# EAGLE design Driver (EAGLE 4.14)
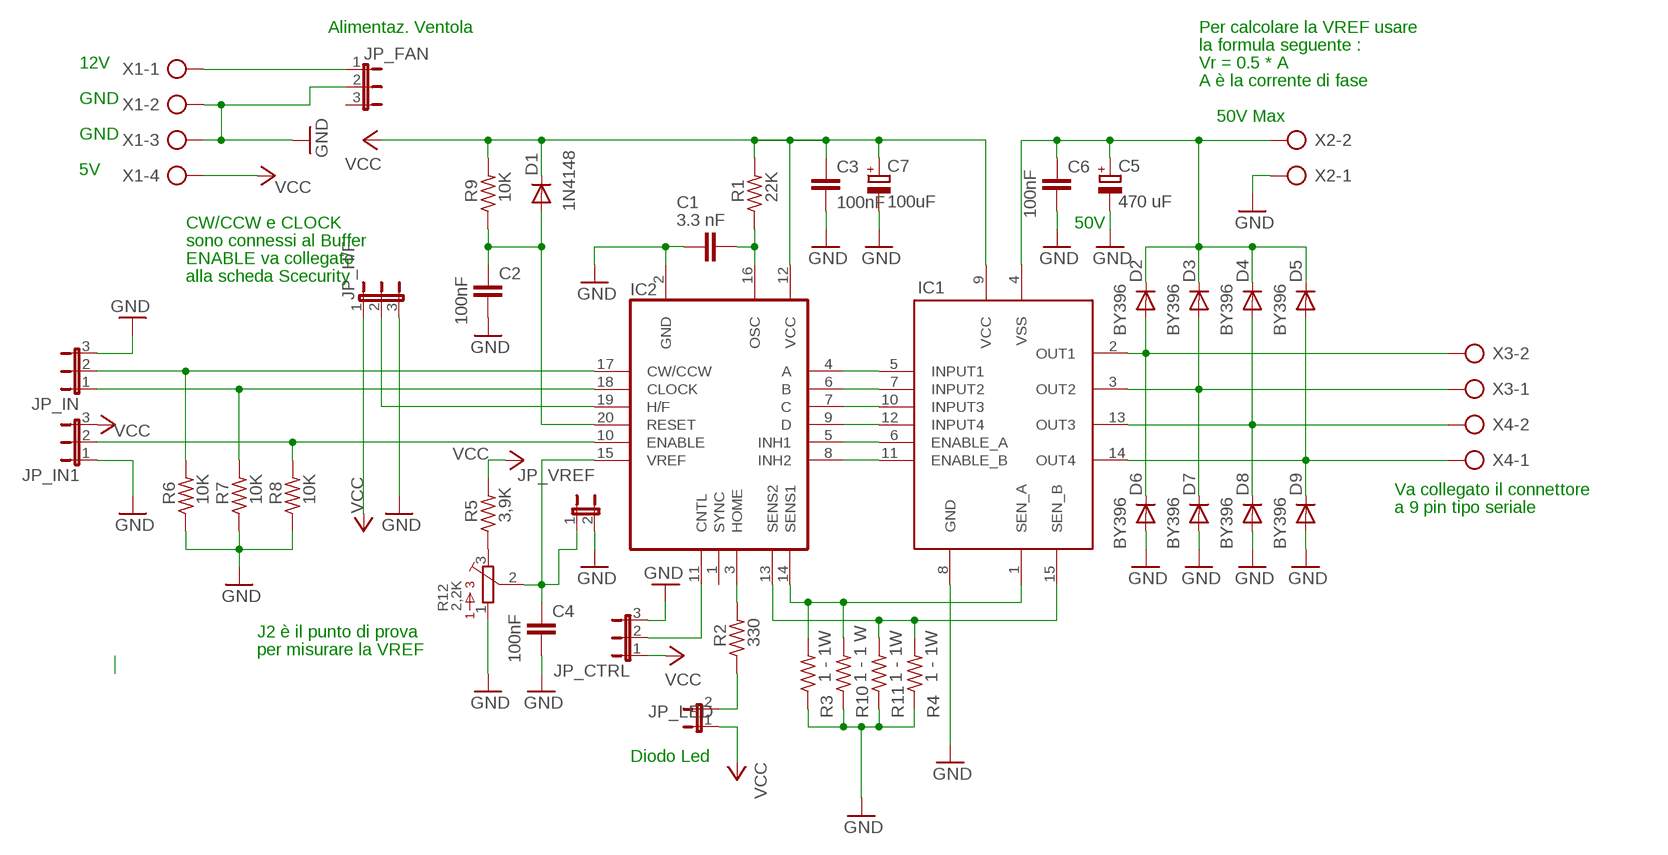
[diagram p0: schematic, sheet 1]

## Parts
C1  3.3 nF  C-EU050-024X044  [C050-024X044]
C2  100nF  C5/2.5  [C5B2.5]
C3  100nF  C5/2.5  [C5B2.5]
C4  100nF  C5/2.5  [C5B2.5]
C5  470 uF  CPOL-EUE5-10.5  [E5-10,5]
C6  100nF  C5/3.5  [C5B3.5]
C7  100uF  CPOL-EUE2.5-5  [E2,5-5]
D1  1N4148  [DO35-10]
D2  BY396  [DO201-15]
D3  BY396  [DO201-15]
D4  BY396  [DO201-15]
D5  BY396  [DO201-15]
D6  BY396  [DO201-15]
D7  BY396  [DO201-15]
D8  BY396  [DO201-15]
D9  BY396  [DO201-15]
IC1  L298  [MW-15]
IC2  L297  [DIL20]
JP_CTRL  JP2E  [JP2]
JP_FAN  JP2E  [JP2]
JP_H/F  JP2E  [JP2]
JP_IN  JP2E  [JP2]
JP_IN1  JP2E  [JP2]
JP_LED  JP1E  [JP1]
JP_VREF  JP1E  [JP1]
R1  22K  R-US_0207/12  [0207/12]
R2  330  R-US_0207/12  [0207/12]
R3  1 - 1W  R-US_0617/22  [0617/22]
R4  1 - 1W  R-US_0617/22  [0617/22]
R5  3,9K  R-US_0207/12  [0207/12]
R6  10K  R-US_0207/12  [0207/12]
R7  10K  R-US_0207/12  [0207/12]
R8  10K  R-US_0207/12  [0207/12]
R9  10K  R-US_0207/12  [0207/12]
R10  1 - 1 W  R-US_0617/22  [0617/22]
R11  1 - 1W  R-US_0617/22  [0617/22]
R12  2,2K  3386-X  [3386X]
X1  AK500/4  [AK500/4]
X2  AK300/2  [AK300/2]
X3  AK300/2  [AK300/2]
X4  AK300/2  [AK300/2]

## Nets
GND: C1.2 C2.2 C3.2 C4.2 C5.- C6.2 C7.- D6.A D7.A D8.A D9.A IC1.8(GND) IC2.2(GND) JP_CTRL.3 JP_FAN.2 JP_H/F.3 JP_IN1.1 JP_IN.3 JP_VREF.2 R3.1 R4.1 R6.1 R7.1 R8.1 R10.1 R11.1 R12.1 X1.2 X1.3 X2.1
N$1: IC2.17(CW/CCW) JP_IN.2 R6.2
N$2: IC2.18(CLOCK) JP_IN.1 R7.2
N$3: IC2.10(ENABLE) JP_IN1.2 R8.2
N$4: IC2.3(HOME) R2.2
N$5: JP_LED.2 R2.1
N$6: IC2.19(H/F) JP_H/F.2
N$7: C1.1 IC2.16(OSC) R1.1
N$8: IC1.12(INPUT4) IC2.9(D)
N$9: IC1.11(ENABLE_B) IC2.8(INH2)
N$10: IC1.10(INPUT3) IC2.7(C)
N$11: IC1.7(INPUT2) IC2.6(B)
N$12: IC1.6(ENABLE_A) IC2.5(INH1)
N$13: IC1.5(INPUT1) IC2.4(A)
N$15: IC1.1(SEN_A) IC2.14(SENS1) R3.2 R10.2
N$16: IC1.15(SEN_B) IC2.13(SENS2) R4.2 R11.2
N$17: JP_FAN.1 X1.1
N$22: C4.1 IC2.15(VREF) JP_VREF.1 R12.2
N$23: C2.1 D1.A IC2.20(RESET) R9.1
N$24: R5.1 R12.3
N$25: IC2.11(CNTL) JP_CTRL.2
N$26: D2.A D6.C IC1.2(OUT1) X3.2
N$27: D3.A D7.C IC1.3(OUT2) X3.1
N$28: D4.A D8.C IC1.13(OUT3) X4.2
N$29: D5.A D9.C IC1.14(OUT4) X4.1
N$30: C5.+ C6.1 D2.C D3.C D4.C D5.C IC1.4(VSS) X2.2
VCC: C3.1 C7.+ D1.C IC1.9(VCC) IC2.12(VCC) JP_CTRL.1 JP_H/F.1 JP_IN1.3 JP_LED.1 R1.2 R5.2 R9.2 X1.4
Unconnected: IC2.1(SYNC) JP_FAN.3

## Notes on the sheet
- Alimentaz. Ventola | Per calcolare la VREF usare
- la formula seguente :
- 12V | Vr = 0.5 * A
- A è la corrente di fase
- GND
- 50V Max
- GND
- 5V
- CW/CCW e CLOCK | 50V
- sono connessi al Buffer
- ENABLE va collegato
- alla scheda Scecurity
- Va collegato il connettore
- a 9 pin tipo seriale
- J2 è il punto di prova
- per misurare la VREF
- Diodo Led

## Library data of the parts
C1 = rcl:C-EU: CAPACITOR, European symbol
C2-C4 C6 = capacitor-wima:C: CAPACITOR naming: grid - package width
C5 C7 = rcl:CPOL-EU: POLARIZED CAPACITOR, European symbol
D1 = diode:1N4148: DIODE high speed (Philips)
D2-D9 = diode:BY396: DIODE Si,100 V, 3 A
IC1 = sgs-thom:L298
IC2 = sgs-thom:L297
JP_CTRL JP_FAN JP_H/F JP_IN JP_IN1 = jumper:JP2E: JUMPER
JP_LED JP_VREF = jumper:JP1E: JUMPER
R1-R11 = rcl:R-US_: RESISTOR, American symbol
R12 = BOURNS:3386-: 3386 Series 3/8" Square Trimmer
X1 = con-ptr500:AK500/4: CONNECTOR
X2-X4 = con-ptr500:AK300/2: CONNECTOR

## Board
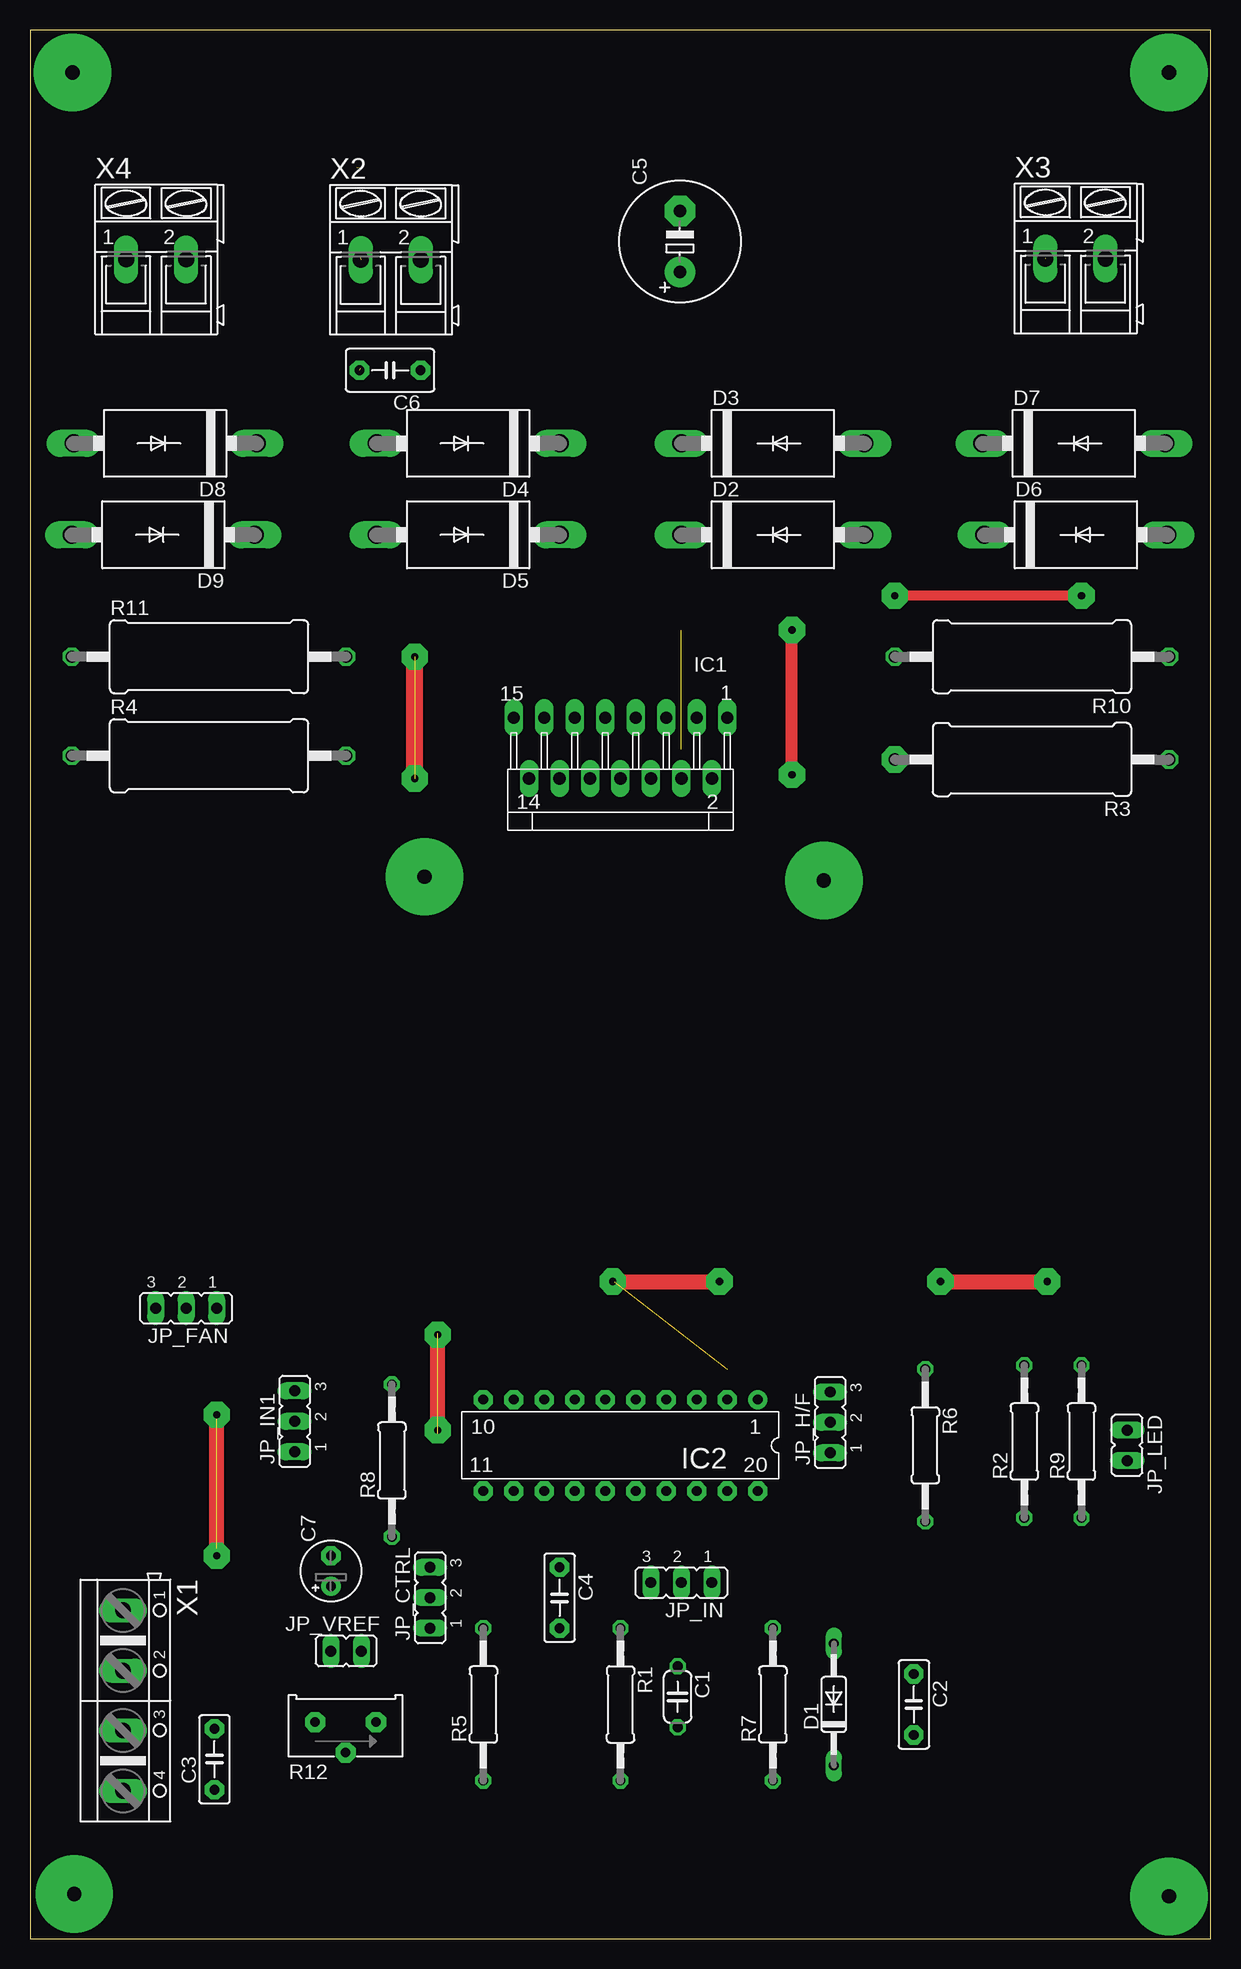
[diagram p1: board, top side]
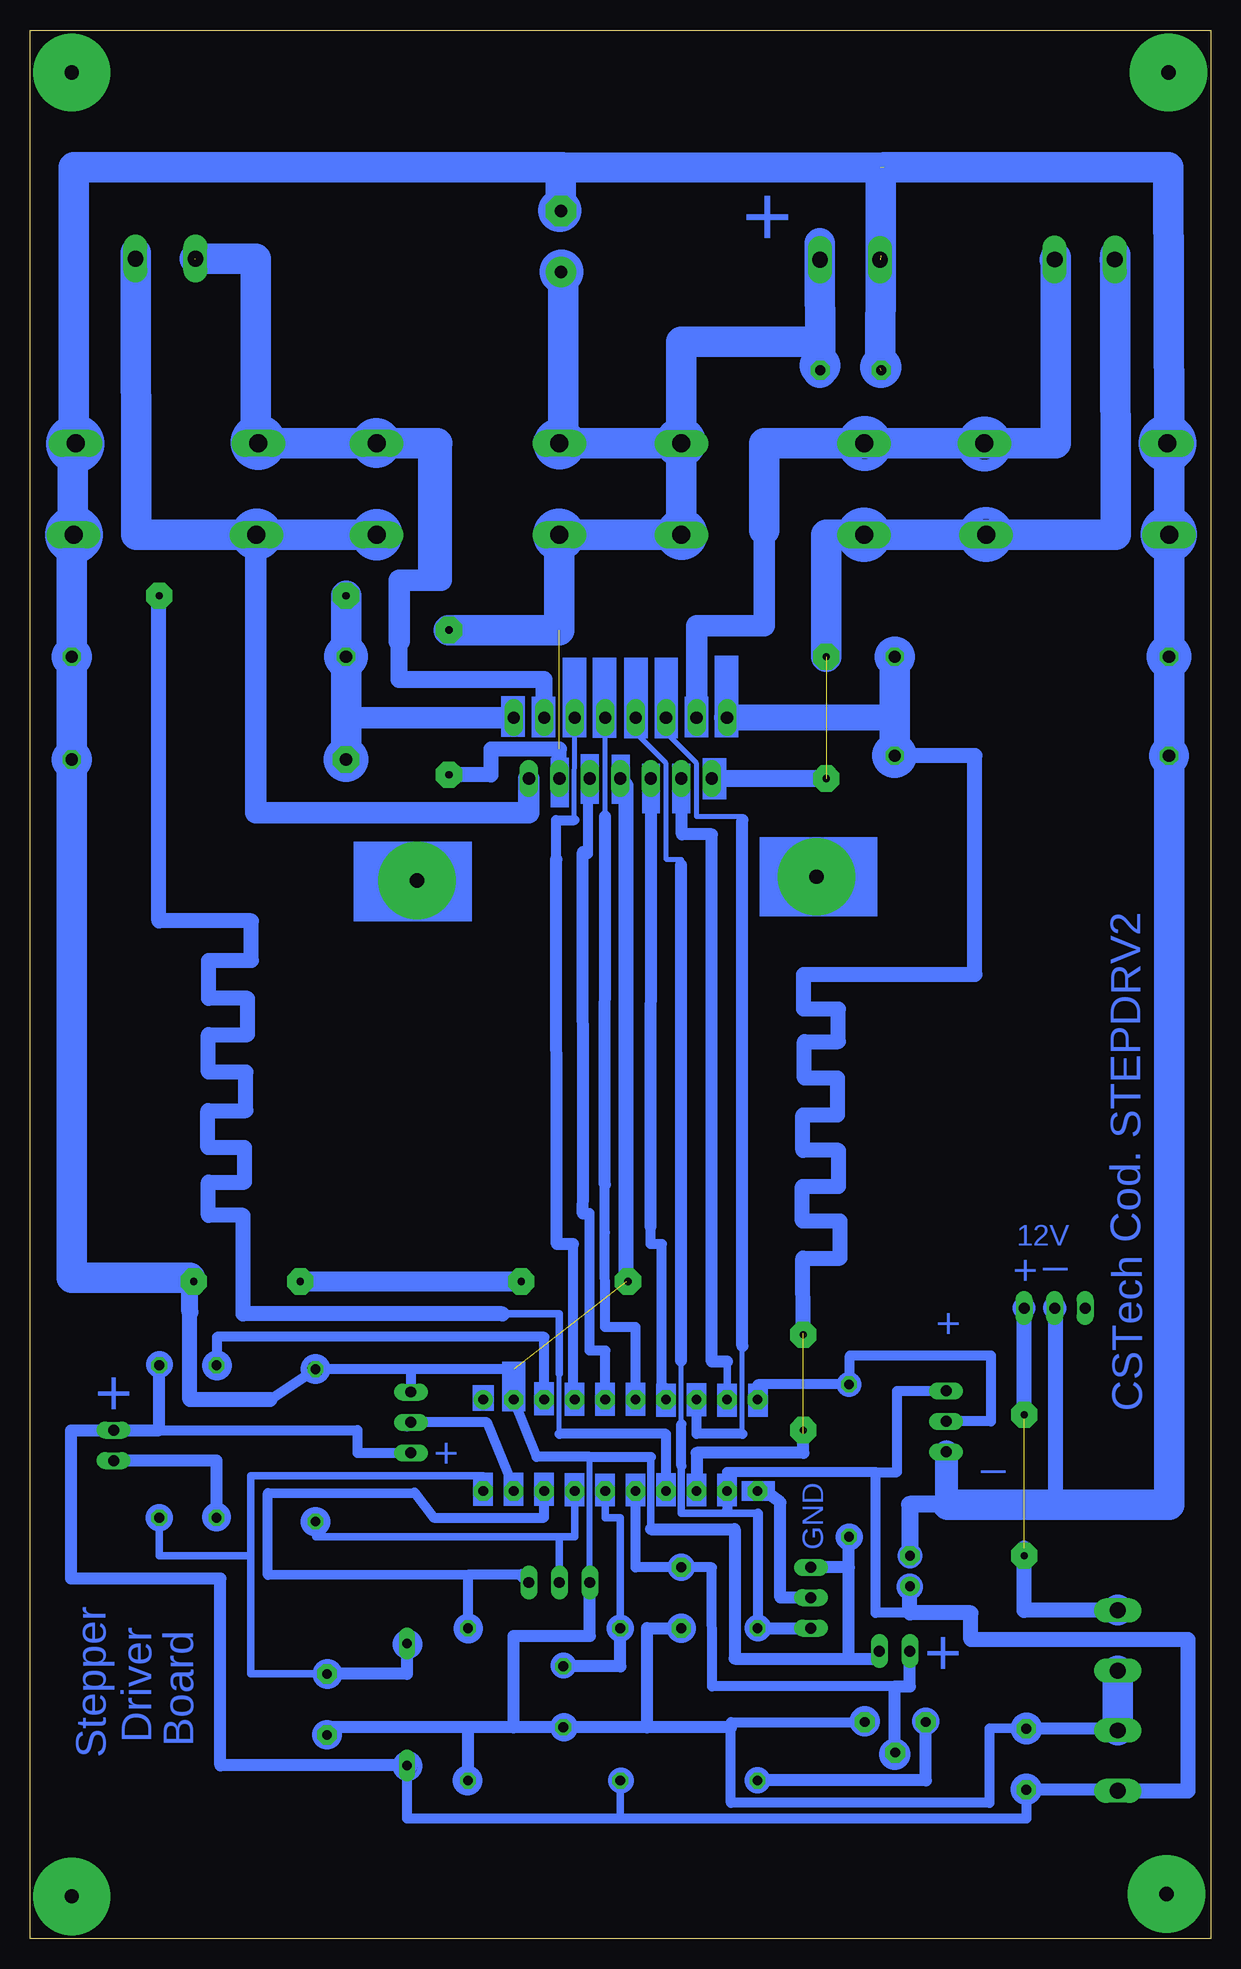
[diagram p2: board, bottom side, seen from below]

Size 98.41 x 159.06 mm. Coordinates in mm from the lower left corner, seen from the top.
Outline: 0,0 98.4,0 98.4,159.05 0,159.05 0,0
Copper layers (1*16): Top 0.035mm / dielectric 1.5mm / Bottom 0.035mm
Design rules "default": minimum track width 20mil, minimum drill 24mil, track to track 8mil, track to pad 8mil, pad to pad 8mil, via to via 8mil, smd to smd 8mil, copper to edge 40mil, drill to drill 8mil, minimum pad ring 10mil, minimum via ring 8mil, stop-mask expansion 4mil, vias tented up to drill 0mil, thermal gap 10mil

### Footprints (pad centres in the part's own frame; a part is rotated, then mirrored left to right if it is on the bottom)
C050-024X044 = drill 0.813 octagon: 1 -2.54,0; 2 2.54,0
C5B2.5 = drill 0.813 pad 1.6 octagon: 1 -2.54,0; 2 2.54,0
E5-10,5 = drill 1.016 pad 2.54 round: + -2.54,0 | drill 1.016 pad 2.54 octagon: - 2.54,0
C5B3.5 = drill 0.813 pad 1.6 octagon: 1 -2.54,0; 2 2.54,0
E2,5-5 = drill 0.813 pad 1.6 round: + -1.27,0 | drill 0.813 pad 1.6 octagon: - 1.27,0
DO35-10 = drill 0.813 long: A 5.08,0; C -5.08,0
DO201-15 = drill 1.499 long: A 7.62,0; C -7.62,0
MW-15 = drill 1.016 pad 1.27 long: 1 -8.89,-5.08; 2 -7.62,0; 3 -6.35,-5.08; 4 -5.08,0; 5 -3.81,-5.08; 6 -2.54,0; 7 -1.27,-5.08; 8 0,0; 9 1.27,-5.08; 10 2.54,0; 11 3.81,-5.08; 12 5.08,0; 13 6.35,-5.08; 14 7.62,0; 15 8.89,-5.08
DIL20 = drill 0.813 pad 1.6 round: 1 -11.43,-3.81 | drill 0.813 pad 1.6 octagon: 2 -8.89,-3.81; 3 -6.35,-3.81; 4 -3.81,-3.81; 5 -1.27,-3.81; 6 1.27,-3.81; 7 3.81,-3.81; 8 6.35,-3.81; 9 8.89,-3.81; 10 11.43,-3.81; 11 11.43,3.81; 12 8.89,3.81; 13 6.35,3.81; 14 3.81,3.81; 15 1.27,3.81; 16 -1.27,3.81; 17 -3.81,3.81; 18 -6.35,3.81; 19 -8.89,3.81; 20 -11.43,3.81
JP2 = drill 0.914 long: 1 -2.54,0; 2 0,0; 3 2.54,0
JP1 = drill 0.914 long: 1 0,-1.27; 2 0,1.27
0207/12 = drill 0.813 octagon: 1 -6.35,0; 2 6.35,0
0617/22 = drill 1.016 octagon: 1 -11.43,0; 2 11.43,0
3386X = drill 0.813 pad 1.676 octagon: 1 2.54,0.635; 2 0,-1.905; 3 -2.54,0.635
AK500/4 = drill 1.321 long: 1 -7.518,0; 2 -2.489,0; 3 2.489,0; 4 7.518,0
AK300/2 = drill 1.321 long: 1 -2.515,0; 2 2.489,0

### Placement (x,y rotation side)
C1  53.97,20.16 270 top
C2  73.66,19.52 270 top
C3  15.37,14.95 90 top
C4  44.13,28.41 270 top
C5  54.16,141.43 90 top
C6  30.01,130.7 180 top
C7  25.08,30.63 90 top
D1  66.99,19.52 90 top
D2  61.91,116.99 0 top
D3  61.91,124.61 0 top
D4  36.51,124.6 180 top
D5  36.51,116.99 180 top
D6  87.16,116.99 0 top
D7  86.99,124.61 0 top
D8  11.26,124.61 180 top
D9  11.11,116.99 180 top
IC1  49.21,96.67 180 top
IC2  49.21,41.11 180 top
JP_CTRL  33.33,28.41 90 top
JP_FAN  13.01,52.54 180 top
JP_H/F  66.67,43.02 90 top
JP_IN  54.29,29.68 180 top
JP_IN1  22.05,43.1 90 top
JP_LED  91.44,41.11 180 top
JP_VREF  26.35,23.96 270 top
R1  49.21,19.52 270 top
R2  82.86,41.43 90 top
R3  83.5,98.26 180 top
R4  14.92,98.58 0 top
R5  37.78,19.52 90 top
R6  74.61,41.11 270 top
R7  61.91,19.52 90 top
R8  30.16,39.84 90 top
R9  87.62,41.43 90 top
R10  83.5,106.83 180 top
R11  14.92,106.83 0 top
R12  26.3,17.41 0 top
X1  7.75,19.84 270 top
X2  30.08,139.9 0 top
X3  87.13,140 0 top
X4  10.52,139.93 0 top

### Tracks (layer width: path | path; a pad name or v marks a point on that pad's centre or on a via)
GND  (4 unrouted)
  Bottom 0.254: 3.49,123.98 D8.A | D9.A 3.49,117.63 | D7.A 94.75,125.88
  Bottom 0.508: C1.2 54.92,17.62 | R6.1 74.4,47.54 | JP_IN.3 51.75,40.16 | D8.A 3.49,125.25 | 94.75,147.47 94.78,147.6
  Bottom 0.61: 46.67,40.16 46.67,34.13
  Bottom 0.813: 46.67,40.16 51.75,40.16 56.19,40.16 IC2.2 58.1,47.46 66.67,47.46 | 66.67,47.46 R6.1 78.42,44.92 | 66.67,47.46 JP_H/F.3 | 25.08,31.59 C7.- | C3.2 18.45,17.51 18.45,11.32 40,11.32 40,17.62 40,18.05 R12.1 | 27.62,23.33 JP_VREF.2 | 94.93,115.72 95.04,115.75
  Bottom 1.016: 58.1,17.62 58.1,25.23 51.75,25.23 JP_IN.3 | 58.1,17.62 C1.2 46.99,17.62 | 46.99,17.62 46.99,25.87 C4.2 | C2.2 73.65,17.62 61.91,17.62 | 58.1,17.62 61.91,17.62 | 40,17.62 46.99,17.62 | 30.16,23.33 30.16,30.95 | 30.16,30.95 R8.1 | 30.16,23.33 39.68,23.33 39.68,34.13 46.67,34.13 | 61.91,17.62 R7.1 | 30.16,23.33 27.62,23.33 | 30.16,30.95 JP_CTRL.3 | X1.3 7.83,17.35 7.83,17.49 C3.2 | D7.A 94.85,124.56 95.49,124.61 | D6.A 94.85,116.94
  Bottom 1.27: 78.42,44.92 85.09,44.92 85.09,52.22 | IC1.8 48.72,96.09 48.7,54.76 | 12.94,36.17 12.94,52.54 | 25.1,31.59 25.08,31.59 | 21.5,36.17 21.5,36.2 21.5,36.27
  Bottom 1.422: 85.09,52.22 85.09,55.08 | 25.1,31.59 25.1,36.2 21.5,36.2
  Bottom 1.778: 12.94,52.54 JP_FAN.2
  Bottom 1.93: JP_IN1.1 22,40.56 22,36.17 21.93,36.17
  Bottom 2.54: 3.49,117.63 3.49,123.98 | D9.A R11.1 3.49,98.9 | D6.A 94.93,115.72 R10.1 R3.1 94.93,55.08 85.09,55.08 | 94.75,125.88 94.75,147.47 | 3.49,125.25 3.56,147.62 27.21,147.62 | 3.49,98.9 R4.1 | X1.3 X1.2 | C5.- 54.19,143.97 54.19,147.55 | 54.19,147.55 54.03,147.6 27.49,147.57 27.49,140.26 27.57,130.86 | 94.78,147.6 54.19,147.6 54.19,147.55 | 94.85,116.94 94.85,124.56 | 3.49,98.9 3.49,36.17 12.94,36.17 21.5,36.17 21.93,36.17
N$1
  Bottom 0.61: R6.2 74.61,33.49 54.29,33.49 | 54.29,33.49 53.02,33.49 IC2.17 | JP_IN.2 54.29,33.49
N$2
  Bottom 0.813: 57.46,30.32 61.91,30.32 | 61.91,30.32 78.58,30.29 78.58,37.13 66.35,37.16 64.76,35.08 55.56,35.08 IC2.18 | 61.91,30.32 R7.2
  Bottom 1.016: JP_IN.1 57.46,30.32
N$3
  Bottom 0.813: IC2.10 37.78,46.19 R8.2 | 30.12,46.19 30.08,46.19 30.08,48.59 18.32,48.59 18.32,43.1 JP_IN1.2
  Bottom 1.016: 30.11,46.2 30.12,46.19 R8.2
N$4
  Bottom 0.813: R2.2 82.84,50.15 55.53,50.15 IC2.3
N$5
  Bottom 1.016: R2.1 82.86,39.84 JP_LED.2
N$6
  Bottom 0.813: IC2.19 58.1,37.62 60.32,43.02 66.99,43.02 | 66.99,43.02 JP_H/F.2 | 66.99,43.02 66.99,42.7
N$7
  Bottom 0.61: R1.1 49.21,35.08 50.48,35.08 IC2.16
  Bottom 1.016: R1.1 49.21,22.7 C1.1
N$8
  Bottom 0.61: IC2.9 40.32,48.1
  Bottom 1.016: 44.1,96.77 44.1,96.67 IC1.12 44.08,96.67 | 40.32,48.1 41.59,48.1 41.59,92.02 44.08,92.02 44.08,96.67 | 44.08,96.67 44.08,96.75
N$9
  Bottom 0.406: IC1.11 45.4,100.48 42.86,97.94 42.86,93.5 39.02,93.5 39.02,93.22 39.05,93.22 | 39.05,42.06 39.05,49.4
  Bottom 0.813: 39.05,42.06 42.86,42.06 IC2.8
  Bottom 1.016: 39.05,49.4 39.05,93.22
N$10
  Bottom 0.61: IC2.7 45.4,45.87
  Bottom 0.813: 45.4,45.87 45.75,45.87 45.75,57.89 46.69,57.89 46.69,59.36
  Bottom 1.016: 46.64,96.67 46.64,96.7 | 46.64,96.67 IC1.10 | 46.69,59.36 46.64,96.67
N$11
  Bottom 0.406: 50.48,93.5 IC1.7
  Bottom 0.813: IC2.6 47.94,50.97 50.43,50.97 50.48,50.98 50.5,58.85 50.5,62.84
  Bottom 1.016: 50.5,62.84 50.48,93.5
N$12
  Bottom 0.813: IC2.5 50.45,49.01 51.77,49.01 51.77,60.45 52.33,60.43 | IC1.6 51.9,96.67 51.9,90.4 | 51.9,90.4 | 52.33,90.4 51.9,90.4
  Bottom 1.016: 52.33,60.43 52.31,62.26 52.33,90.4 52.33,90.55
N$13
  Bottom 0.406: 53.04,93.22 IC1.5
  Bottom 0.61: IC2.4 53.14,44.92
  Bottom 0.813: 53.14,44.92 53.14,57.89 | 53.04,93.22 54.57,93.22 54.57,89.94
  Bottom 1.016: 54.57,89.94 54.54,89.94 54.49,57.89 53.14,57.89
N$14  (via drill 0.6 pad 2.18)
  Top 1.27: v15.55,31.9 v15.55,43.65
N$15  (via drill 0.6 pad 2.18)
  Top 0.813: v87.62,111.91 v72.07,111.91
  Bottom 0.254: R3.2 71.43,98.58
  Bottom 0.406: 54.29,42.06 54.29,47.08
  Bottom 0.61: 54.29,47.08 54.31,52.06 59.05,52.06
  Bottom 0.813: IC2.14 45.4,42.06 54.29,42.06 | R3.2 72.38,98.26 72.38,98.58
  Bottom 1.27: 59.05,52.06 80.64,52.06 80.64,60.27 83.55,60.27 83.55,63.04 80.53,63.04 80.53,65.91 83.57,65.91 83.57,69.01 80.42,69.01 80.42,72.21 83.55,72.21 83.55,75.34 80.27,75.34 80.27,78.36 83.52,78.36 83.52,81.53 79.97,81.53 79.97,84.81 87.66,84.81 87.66,111.91 v87.62,111.91
  Bottom 1.778: 72.07,98.58 72.38,98.58 | 72.07,101.75 IC1.1
  Bottom 2.54: R3.2 72.07,98.58 72.07,101.75 R10.2 v72.07,111.91
  other vias: 72.07,98.26
N$16  (1 unrouted)
  Bottom 1.016: IC2.13 42.86,40.47 33.97,40.47 33.97,42.06
  Bottom 1.27: R4.2 19.67,98.58 19.67,80.37 33.94,80.37 33.94,77.47 31.05,77.47 31.05,74.75 33.87,74.75 33.87,71.7 31.1,71.7 31.1,68.66 33.99,68.66 33.99,65.68 31.02,65.68 31.02,62.69 34.04,62.69 34.04,59.79 30.89,59.79 30.89,56.72 33.99,56.72 33.97,50.44 33.89,50.44
  Bottom 2.184: 26.35,101.75 IC1.15
  Bottom 2.54: R4.2 26.35,101.75 R11.2
N$17  (1 unrouted)
  Bottom 0.508: 15.55,45.24 15.7,45.21
  Bottom 1.27: X1.1 15.55,27.36 15.55,32.54 | 15.55,43.33 15.55,45.24 JP_FAN.1
N$18  (via drill 0.6 pad 2.18)
  Top 1.422: v32.06,96.67 v32.06,106.83
N$19  (via drill 0.6 pad 2.18)
  Top 1.27: v48.57,54.76 v57.46,54.76 | v75.88,54.76 v84.77,54.76
  Bottom 1.676: v57.46,54.76 v75.88,54.76
N$20  (via drill 0.6 pad 2.18)
  Top 1.27: v33.97,42.38 v33.97,50.32
N$21  (via drill 0.6 pad 2.18)
  Top 1.016: 63.49,96.99 v63.49,109.05
N$22
  Bottom 0.813: IC2.15 47.94,30.95 C4.1 41.59,30.95 41.56,21.02 26.32,21.02
  Bottom 1.016: JP_VREF.1 25.08,21.02 26.32,21.02 26.35,15.51 R12.2
N$23
  Bottom 0.61: 80.01,31.9 80.01,38.57 60.64,38.57 IC2.20 | C2.1 80.01,22.06 80.01,31.9 | 80.01,31.9 87.62,31.9 R9.1
  Bottom 1.016: D1.A 66.99,22.06 C2.1
N$24
  Bottom 0.813: R5.1
  Bottom 1.016: R12.3 23.76,13.18 R5.1
N$25
  Bottom 0.813: IC2.11 38.1,37.3
  Bottom 1.016: IC2.11 37.14,37.3 35.87,36.35 35.87,28.41 JP_CTRL.2
N$26
  Bottom 0.508: X3.2 89.31,139.88 89.58,140.51
  Bottom 1.778: IC1.2 56.83,93.81 79.59,93.81 79.59,116.99 D6.C
  Bottom 2.54: D2.A D6.C 89.56,116.99 89.58,140.51
N$27  (1 unrouted)
  Bottom 0.406: 84.23,139.67 X3.1
  Bottom 0.508: 64.13,123.98 63.81,123.98 64.45,124.61
  Bottom 1.422: IC1.3 55.56,104.93 67.65,104.93 67.65,108.1 | D7.C 79.57,124.61
  Bottom 1.778: 64.13,124.29 64.13,123.98 64.13,113.18 67.65,113.18 67.65,108.1
  Bottom 2.54: 64.45,124.61 D3.A D7.C | 79.57,124.61 79.57,140 84.67,140
N$28
  Bottom 0.254: D4.A 30.79,124.61
  Bottom 1.27: D4.A 28.89,125.25 29.21,125.25
  Bottom 1.778: IC1.13 42.86,109.4 37.22,109.4 37.22,117.36
  Bottom 2.54: 37.22,117.36 37.22,124.6 D4.A D8.C 12.91,124.6 12.91,136.86 12.94,136.86 12.94,139.93 | 12.94,139.93 12.94,140.13 | 12.94,139.93 X4.2
N$29  (1 unrouted)
  Bottom 1.422: 32.06,96.67 IC1.14
  Bottom 2.54: 28.57,116.99 D9.C 7.93,116.99 7.96,137.31 7.98,137.31 7.98,139.93 | 28.57,116.99 D5.A | 28.57,116.99 32.06,116.99 32.06,106.83 | 7.98,139.93 7.98,140.31 | 7.98,139.93 X4.1
N$30  (via drill 0.6 pad 2.18)  (1 unrouted)
  Bottom 0.254: 32.6,141.3 X2.2 | C6.1 33.38,133.1 | 44.13,125.25 D4.C
  Bottom 0.508: 54.64,124.61 55.2,124.74
  Bottom 1.27: IC1.4 54.29,99.14 60,99.14 60,96.99 v63.49,96.99
  Bottom 1.422: D4.C 46.03,124.61 | D3.C 54.64,124.61
  Bottom 2.54: C6.1 32.6,141.3 | 46.03,124.61 D3.C 53.98,124.61 53.98,138.89 C5.+ | 33.38,133.1 44.13,133.1 44.13,125.25 | 54.64,124.61 55.24,124.61 | D4.C D5.C D2.C 54.29,109.05 63.49,109.05
N$31  (via drill 1.2 pad 6.45)
  other vias: 3.54,155.52
N$32  (via drill 1.2 pad 6.45)
  other vias: 94.93,155.52
N$33  (via drill 1.2 pad 6.45)
  other vias: 3.69,3.73
N$34  (via drill 1.2 pad 6.45)
  other vias: 94.93,3.53
N$35  (via drill 1.2 pad 6.45)
  other vias: 66.15,88.16
N$36  (via drill 1.2 pad 6.45)
  other vias: 32.88,88.49
VCC
  Bottom 0.406: 44.13,39.4 44.13,42.85 | 44.13,42.9 44.13,48.17 44.15,48.17 | IC1.9 47.94,100.48 45.4,97.94 45.37,89.92 44.13,89.92 44.13,89.46 44.15,89.46
  Bottom 0.61: 44.13,39.4 44.13,35.43 40.63,35.43 | 40.63,35.43 40.32,35.71 IC2.12 | 49.21,9.99 R1.2 | 40.63,35.43 37.75,35.43 | 44.13,42.85 44.13,42.9
  Bottom 0.813: D1.C 66.99,9.99 49.21,9.99 15.37,9.99 C3.1 | JP_H/F.1 71.12,40.47 71.12,42.38 87.62,42.38 | C7.+ 25.08,29.68 | 25.08,27.14 27.94,27.14 27.94,38.89 | 40.32,35.71 40.32,38.89 27.94,38.89 | 37.75,35.43 R5.2 | 44.13,39.4 44.13,42.9 | 27.94,38.89 26.14,38.89 26.14,45.64 21.98,45.64 | 21.98,45.64 JP_IN1.3 | 21.98,45.64 21.98,45.67
  Bottom 1.016: R9.2 87.62,42.38 JP_LED.1 94.98,42.35 94.98,30 82.54,30 82.54,14.44 D1.C | R5.2 JP_CTRL.1 | 44.15,48.17 44.15,89.46 | X1.4 7.42,12.32 7.42,12.41 C3.1
  Bottom 1.27: X1.4 1.9,12.32 1.9,24.92 20,24.92 20,27.14 25.08,27.14 C7.+
(copper drawn outside any net)
  shapes: Bottom area x45, Bottom circle x91

### Text on the board
Bottom: + | Cod. STEPDRV2 | 12V | _ | + | + | CSTech | + | _ | + | GND | + | Board | Driver | Stepper